# Altium schematic sheet IO_extender.SchDoc
size A4
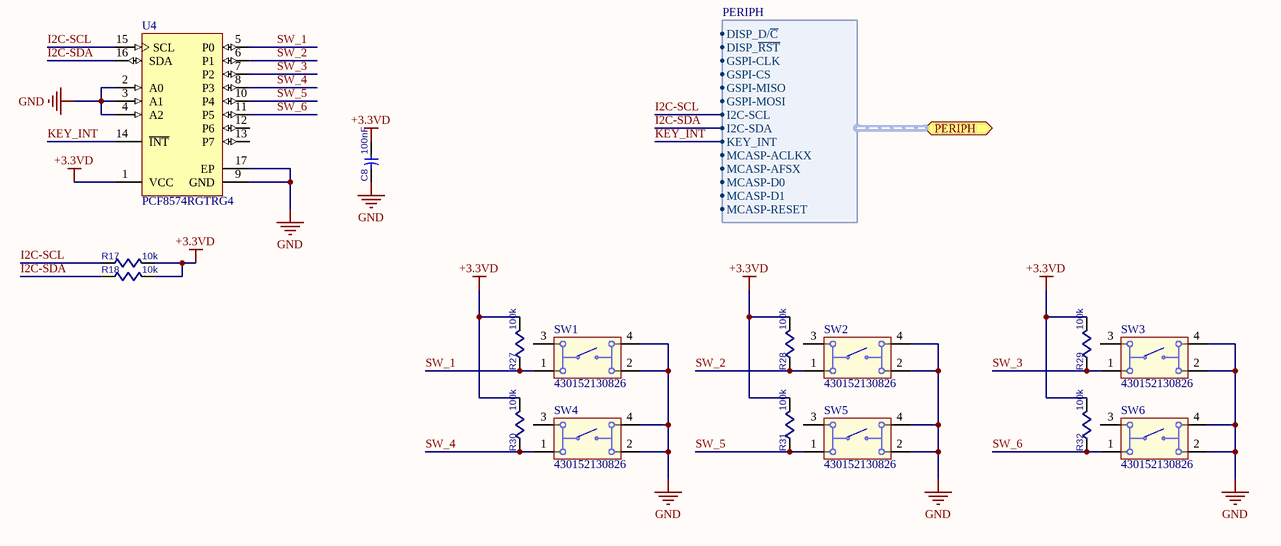
[diagram p0: IO_extender.SchDoc]

## Parts
C8  100nF  [C_0603A]
R17  10k  [R_0603]
R18  10k  [R_0603]
R27  100k  [R_0603]
R28  100k  [R_0603]
R29  100k  [R_0603]
R30  100k  [R_0603]
R31  100k  [R_0603]
R32  100k  [R_0603]
SW1  430152130826  [430152130826]
SW2  430152130826  [430152130826]
SW3  430152130826  [430152130826]
SW4  430152130826  [430152130826]
SW5  430152130826  [430152130826]
SW6  430152130826  [430152130826]
U4  PCF8574RGTRG4  [RGT16-1600X1600TP]

## Ports
PERIPH (harness PERIPH)

## Harnesses
PERIPH: DISP_D/~{C}, DISP_~{RST}, GSPI-CLK, GSPI-CS, GSPI-MISO, GSPI-MOSI, I2C-SCL, I2C-SDA, KEY_INT, MCASP-ACLKX, MCASP-AFSX, MCASP-D0, MCASP-D1, MCASP-RESET

## Nets
+3.3VD: C8.1 R17.1 R18.1 R27.1 R28.1 R29.1 R30.1 R31.1 R32.1 U4.1(VCC)
GND: C8.2 SW1.2 SW1.4 SW2.2 SW2.4 SW3.2 SW3.4 SW4.2 SW4.4 SW5.2 SW5.4 SW6.2 SW6.4 U4.2(A0) U4.3(A1) U4.4(A2) U4.9(GND) U4.17(EP)
I2C-SCL: R17.2 U4.15(SCL) ; port PERIPH.I2C-SCL
I2C-SDA: R18.2 U4.16(SDA) ; port PERIPH.I2C-SDA
KEY_INT: U4.14(~{INT}) ; port PERIPH.KEY_INT
SW_1: R27.2 SW1.1 U4.5(P0)
SW_2: R28.2 SW2.1 U4.6(P1)
SW_3: R29.2 SW3.1 U4.7(P2)
SW_4: R30.2 SW4.1 U4.8(P3)
SW_5: R31.2 SW5.1 U4.10(P4)
SW_6: R32.2 SW6.1 U4.11(P5)

Not connected (* = marked no-connect by the designer): SW1 3; SW2 3; SW3 3; SW4 3; SW5 3; SW6 3; U4 12(P6) 13(P7)

## Library data of the parts
C8 = C_0603: PackageReference: C_0603; VALUE: 100nF
R17 R18 R27-R32 = R_0603: PackageReference: R_0603
  R17 R18: VALUE: 10k
  R27-R32: VALUE: 100k
SW1-SW6 = CMP-1452-00011-1: WS-TASV SMD Tact Switch 6X6 mm; Manufacturer: Wuerth Elektronik; NoPins: 04; ComponentLink1Description: Manufacturer URL; ComponentLink1URL: http://www.we-online.com; PartNumber: 430152130826; ComponentLink2Description: Datasheet; PackageReference: 430152130826; ComponentLink2URL: http://katalog.we-online.de/em/datasheet/4301x2.pdf
U4 = CMP-0314-00047-1: Remote 8-Bit I/O Expander for I2C-Bus, 2.5 to 6 V, -40 to 85 degC, 16-pin QFN (RGT), Green (RoHS & no Sb/Br); Manufacturer: Texas Instruments; # of I/Os: 8; VCC(Max)(V): 6; I2C Address: 0100 xxx; Vcc range(V): 2.5 to 6.0; Push-Pull I/O Type: Yes; Max Frequency(kHz): 100; VCC(Min)(V): 2.5; fSCLK(Max)(MHz): 0.1; SubFamily: I2C IO Expander; Voltage Nodes(V): 5, 3.3; Code_JEDEC: MO-220; PackageReference: RGT16-1600X1600TP; DatasheetVersion: SCPS068G; ComponentLink1URL: http://www.ti.com/general/docs/lit/getliterature.tsp?genericPartNumber=PCF8574&fileType=pdf; PackageVersion: revH, Oct-2011; PartNumber: PCF8574RGTRG4; PackageDescription: 16-Pin Plastic Quad Flatpack No-Lead, 3 x 3 mm Body, 0.5 mm Pitch; Eco-Plan: Green (RoHS & no Sb/Br); Mounting Technology: Surface Mount; Interrupt Output: Yes; ComponentLink2URL: http://www.ti.com/litv/pdf/mpds006c; Reset Input: No; ComponentLink1Description: Datasheet; ComponentLink2Description: Package Specification